# EAGLE design Anschlussfeld (EAGLE 5.09)
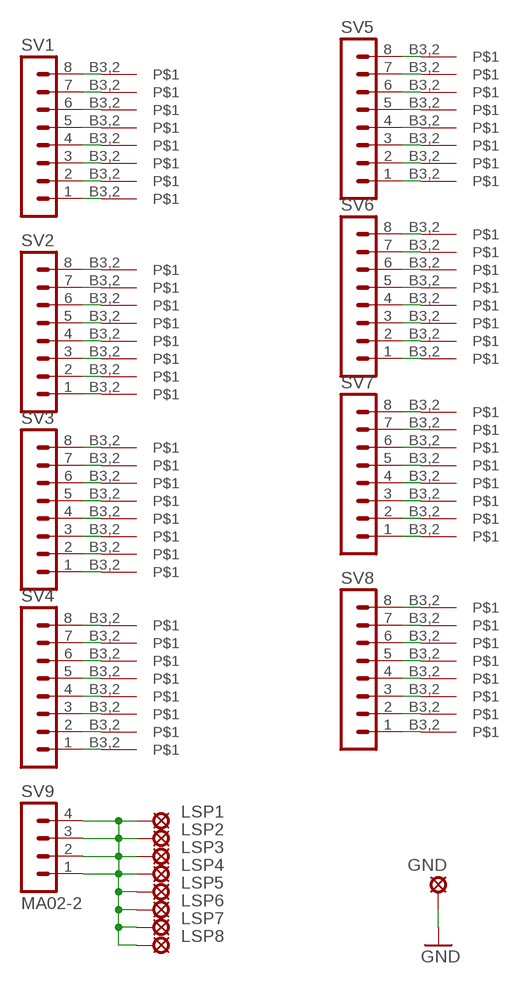
[diagram p0: schematic, sheet 1]

## Parts
GND  SE14  [SE14]
L1  SOLPAD_2,5  [3,2-PAD]
L2  SOLPAD_2,5  [3,2-PAD]
L3  SOLPAD_2,5  [3,2-PAD]
L4  SOLPAD_2,5  [3,2-PAD]
L5  SOLPAD_2,5  [3,2-PAD]
L6  SOLPAD_2,5  [3,2-PAD]
L7  SOLPAD_2,5  [3,2-PAD]
L8  SOLPAD_2,5  [3,2-PAD]
L9  SOLPAD_2,5  [3,2-PAD]
L10  SOLPAD_2,5  [3,2-PAD]
L11  SOLPAD_2,5  [3,2-PAD]
L12  SOLPAD_2,5  [3,2-PAD]
L13  SOLPAD_2,5  [3,2-PAD]
L14  SOLPAD_2,5  [3,2-PAD]
L15  SOLPAD_2,5  [3,2-PAD]
L16  SOLPAD_2,5  [3,2-PAD]
L17  SOLPAD_2,5  [3,2-PAD]
L18  SOLPAD_2,5  [3,2-PAD]
L19  SOLPAD_2,5  [3,2-PAD]
L20  SOLPAD_2,5  [3,2-PAD]
L21  SOLPAD_2,5  [3,2-PAD]
L22  SOLPAD_2,5  [3,2-PAD]
L23  SOLPAD_2,5  [3,2-PAD]
L24  SOLPAD_2,5  [3,2-PAD]
L25  SOLPAD_2,5  [3,2-PAD]
L26  SOLPAD_2,5  [3,2-PAD]
L27  SOLPAD_2,5  [3,2-PAD]
L28  SOLPAD_2,5  [3,2-PAD]
L29  SOLPAD_2,5  [3,2-PAD]
L30  SOLPAD_2,5  [3,2-PAD]
L31  SOLPAD_2,5  [3,2-PAD]
L32  SOLPAD_2,5  [3,2-PAD]
L33  SOLPAD_2,5  [3,2-PAD]
L34  SOLPAD_2,5  [3,2-PAD]
L35  SOLPAD_2,5  [3,2-PAD]
L36  SOLPAD_2,5  [3,2-PAD]
L37  SOLPAD_2,5  [3,2-PAD]
L38  SOLPAD_2,5  [3,2-PAD]
L39  SOLPAD_2,5  [3,2-PAD]
L40  SOLPAD_2,5  [3,2-PAD]
L41  SOLPAD_2,5  [3,2-PAD]
L42  SOLPAD_2,5  [3,2-PAD]
L43  SOLPAD_2,5  [3,2-PAD]
L44  SOLPAD_2,5  [3,2-PAD]
L45  SOLPAD_2,5  [3,2-PAD]
L46  SOLPAD_2,5  [3,2-PAD]
L47  SOLPAD_2,5  [3,2-PAD]
L48  SOLPAD_2,5  [3,2-PAD]
L49  SOLPAD_2,5  [3,2-PAD]
L50  SOLPAD_2,5  [3,2-PAD]
L51  SOLPAD_2,5  [3,2-PAD]
L52  SOLPAD_2,5  [3,2-PAD]
L53  SOLPAD_2,5  [3,2-PAD]
L54  SOLPAD_2,5  [3,2-PAD]
L55  SOLPAD_2,5  [3,2-PAD]
L56  SOLPAD_2,5  [3,2-PAD]
L57  SOLPAD_2,5  [3,2-PAD]
L58  SOLPAD_2,5  [3,2-PAD]
L59  SOLPAD_2,5  [3,2-PAD]
L60  SOLPAD_2,5  [3,2-PAD]
L61  SOLPAD_2,5  [3,2-PAD]
L62  SOLPAD_2,5  [3,2-PAD]
L63  SOLPAD_2,5  [3,2-PAD]
L64  SOLPAD_2,5  [3,2-PAD]
LSP1  SE14  [SE14]
LSP2  SE14  [SE14]
LSP3  SE14  [SE14]
LSP4  SE14  [SE14]
LSP5  SE14  [SE14]
LSP6  SE14  [SE14]
LSP7  SE14  [SE14]
LSP8  SE14  [SE14]
SV1  MA04-2  [MA04-2]
SV2  MA04-2  [MA04-2]
SV3  MA04-2  [MA04-2]
SV4  MA04-2  [MA04-2]
SV5  MA04-2  [MA04-2]
SV6  MA04-2  [MA04-2]
SV7  MA04-2  [MA04-2]
SV8  MA04-2  [MA04-2]
SV9  MA02-2  [MA02-2]

## Nets
GND: GND.MP
N$1: L9.B3,2 SV2.8
N$2: L10.B3,2 SV2.7
N$3: L11.B3,2 SV2.6
N$4: L12.B3,2 SV2.5
N$5: L13.B3,2 SV2.4
N$6: L14.B3,2 SV2.3
N$7: L15.B3,2 SV2.2
N$8: L16.B3,2 SV2.1
N$9: L1.B3,2 SV1.8
N$10: L2.B3,2 SV1.7
N$11: L3.B3,2 SV1.6
N$12: L4.B3,2 SV1.5
N$13: L5.B3,2 SV1.4
N$14: L6.B3,2 SV1.3
N$15: L7.B3,2 SV1.2
N$16: L8.B3,2 SV1.1
N$17: L17.B3,2 SV3.8
N$18: L18.B3,2 SV3.7
N$19: L19.B3,2 SV3.6
N$20: L20.B3,2 SV3.5
N$21: L21.B3,2 SV3.4
N$22: L22.B3,2 SV3.3
N$23: L23.B3,2 SV3.2
N$24: L24.B3,2 SV3.1
N$25: L25.B3,2 SV4.8
N$26: L26.B3,2 SV4.7
N$27: L27.B3,2 SV4.6
N$28: L28.B3,2 SV4.5
N$29: L29.B3,2 SV4.4
N$30: L30.B3,2 SV4.3
N$31: L31.B3,2 SV4.2
N$32: L32.B3,2 SV4.1
N$33: L33.B3,2 SV5.8
N$34: L34.B3,2 SV5.7
N$35: L35.B3,2 SV5.6
N$36: L36.B3,2 SV5.5
N$37: L37.B3,2 SV5.4
N$38: L38.B3,2 SV5.3
N$39: L39.B3,2 SV5.2
N$40: L40.B3,2 SV5.1
N$41: L41.B3,2 SV6.8
N$42: L42.B3,2 SV6.7
N$43: L43.B3,2 SV6.6
N$44: L44.B3,2 SV6.5
N$45: L45.B3,2 SV6.4
N$46: L46.B3,2 SV6.3
N$47: L47.B3,2 SV6.2
N$48: L48.B3,2 SV6.1
N$49: L49.B3,2 SV7.8
N$50: L50.B3,2 SV7.7
N$51: L51.B3,2 SV7.6
N$52: L52.B3,2 SV7.5
N$53: L53.B3,2 SV7.4
N$54: L54.B3,2 SV7.3
N$55: L55.B3,2 SV7.2
N$56: L56.B3,2 SV7.1
N$57: L57.B3,2 SV8.8
N$58: L58.B3,2 SV8.7
N$59: L59.B3,2 SV8.6
N$60: L60.B3,2 SV8.5
N$61: L61.B3,2 SV8.4
N$62: L62.B3,2 SV8.3
N$63: L63.B3,2 SV8.2
N$64: L64.B3,2 SV8.1
N$65: LSP1.MP LSP2.MP LSP3.MP LSP4.MP LSP5.MP LSP6.MP LSP7.MP LSP8.MP SV9.1 SV9.2 SV9.3 SV9.4

## Library data of the parts
GND LSP1-LSP8 = solpad:SE14: SOLDER PAD E1553, drill 1,4mm, distributor Buerklin, 07F820
L1-L64 = bbstghs:SOLPAD_2,5
SV1-SV8 = bbstghs:MA04-2: PIN HEADER
SV9 = bbstghs:MA02-2

## Board
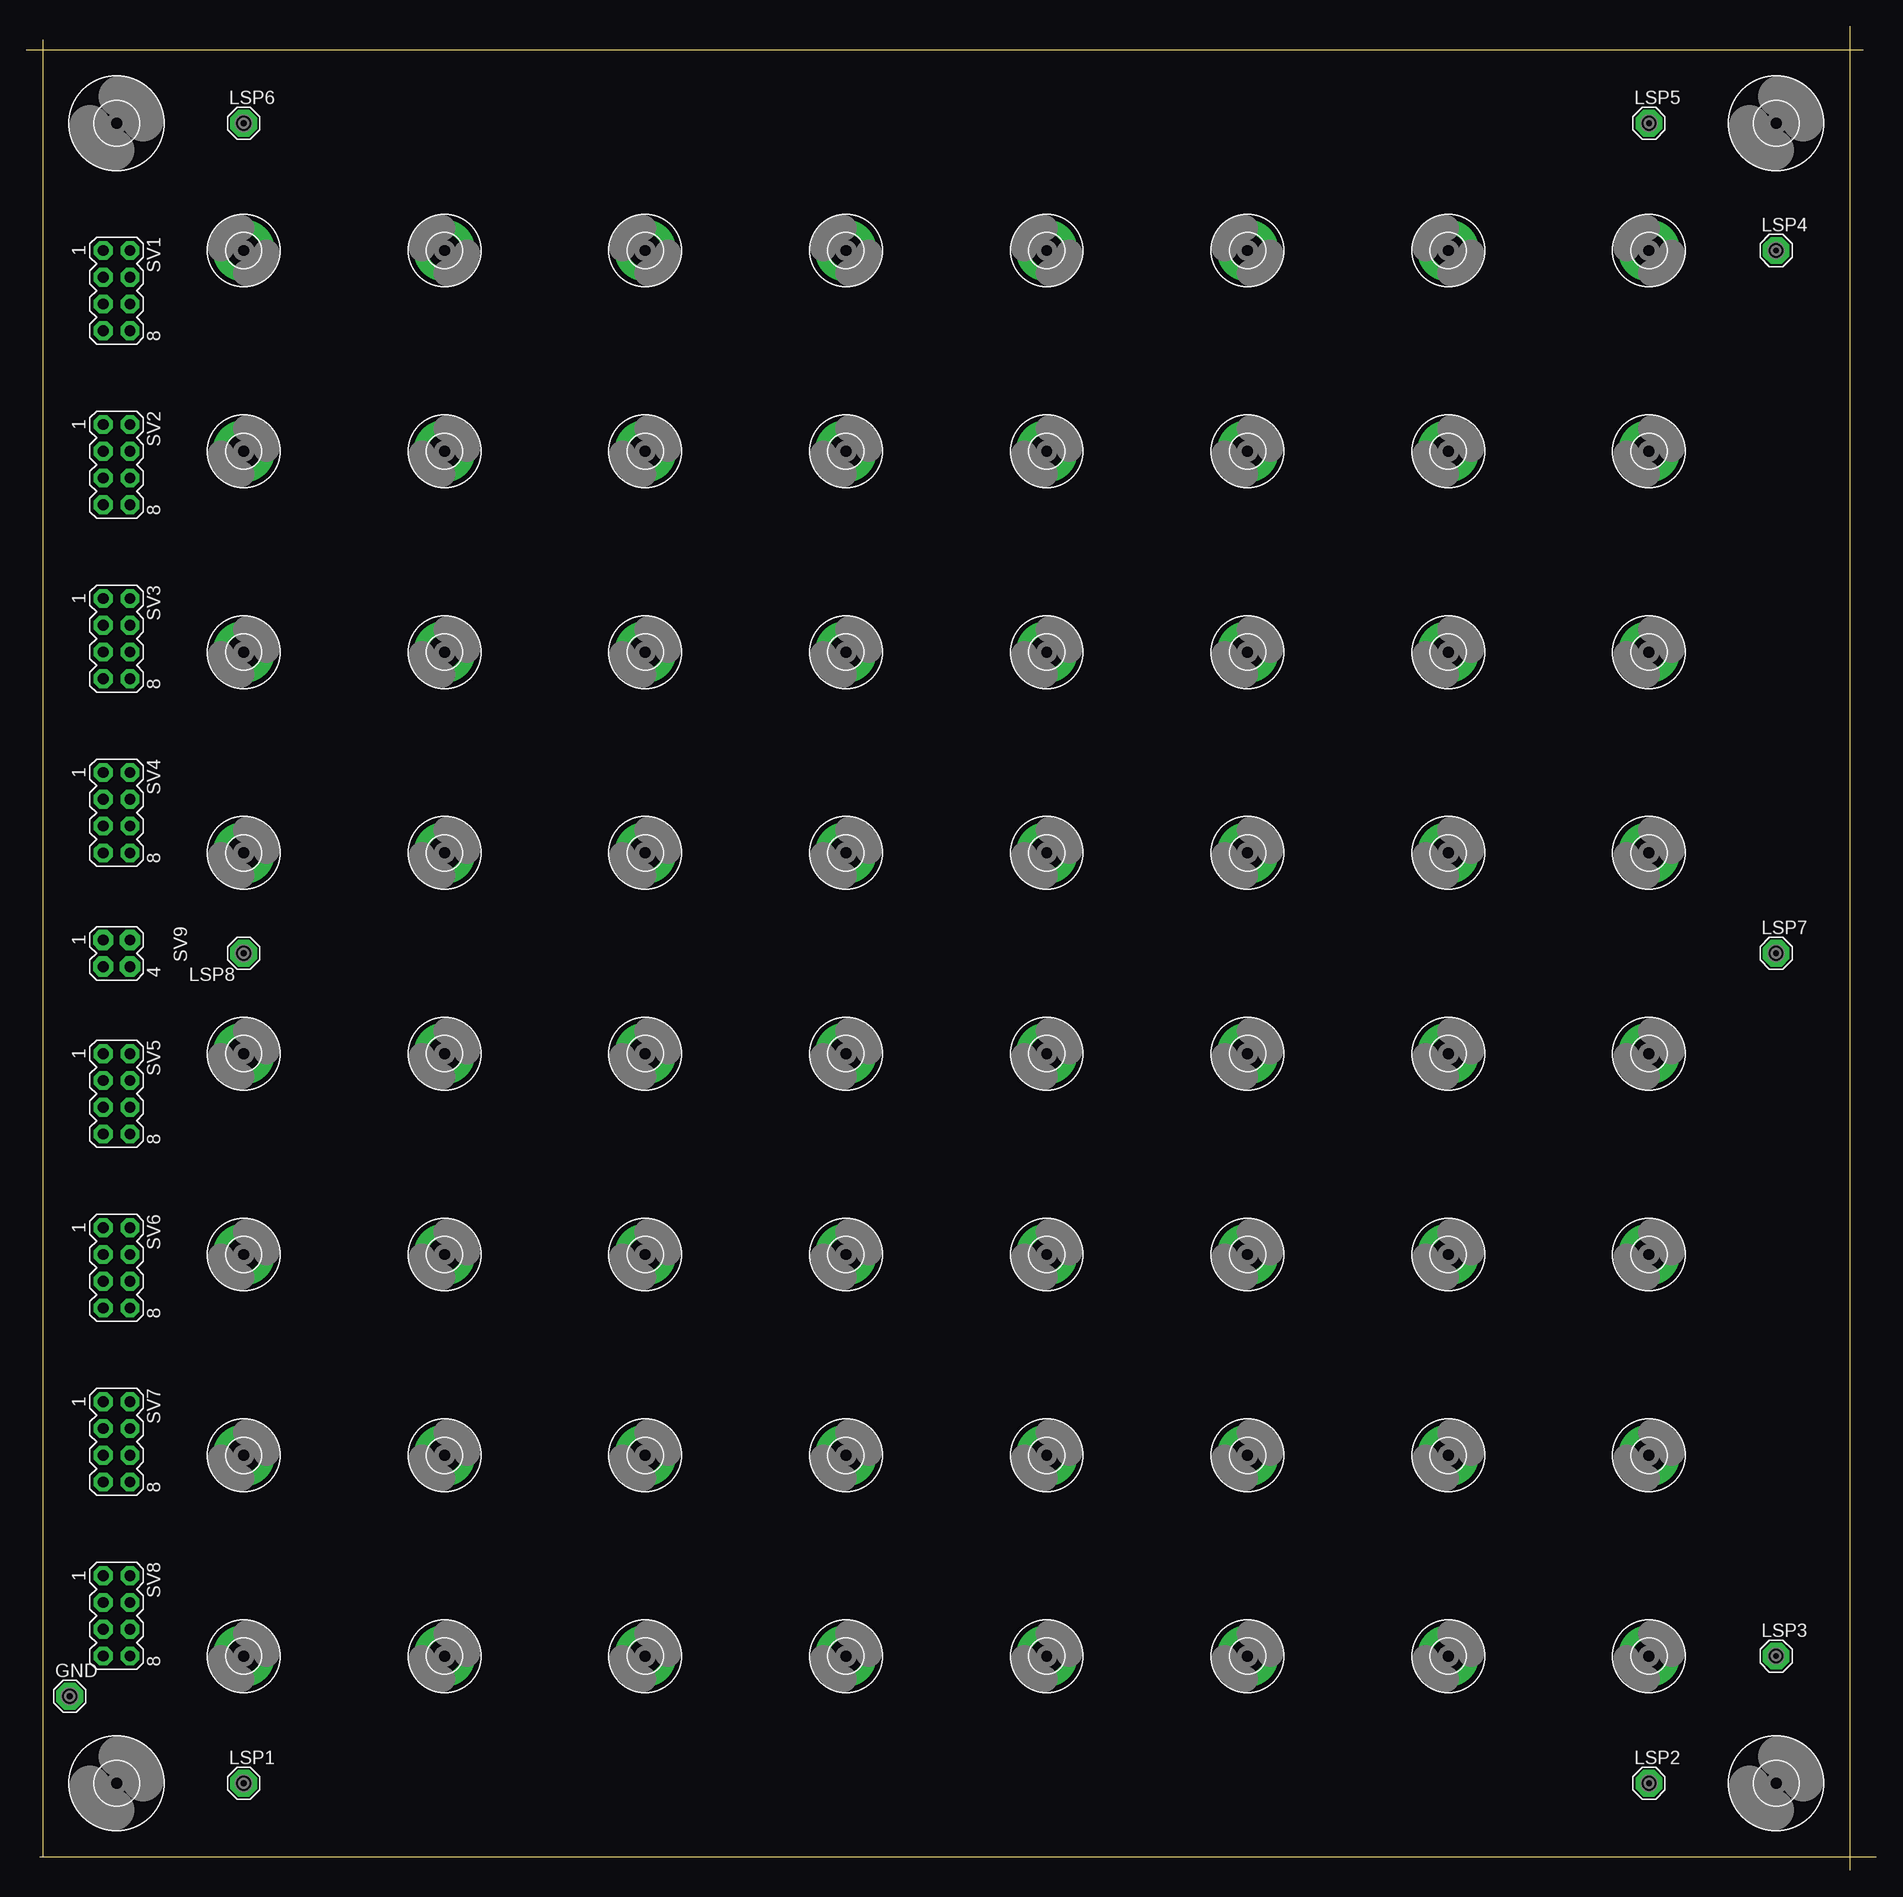
[diagram p1: board, top side]
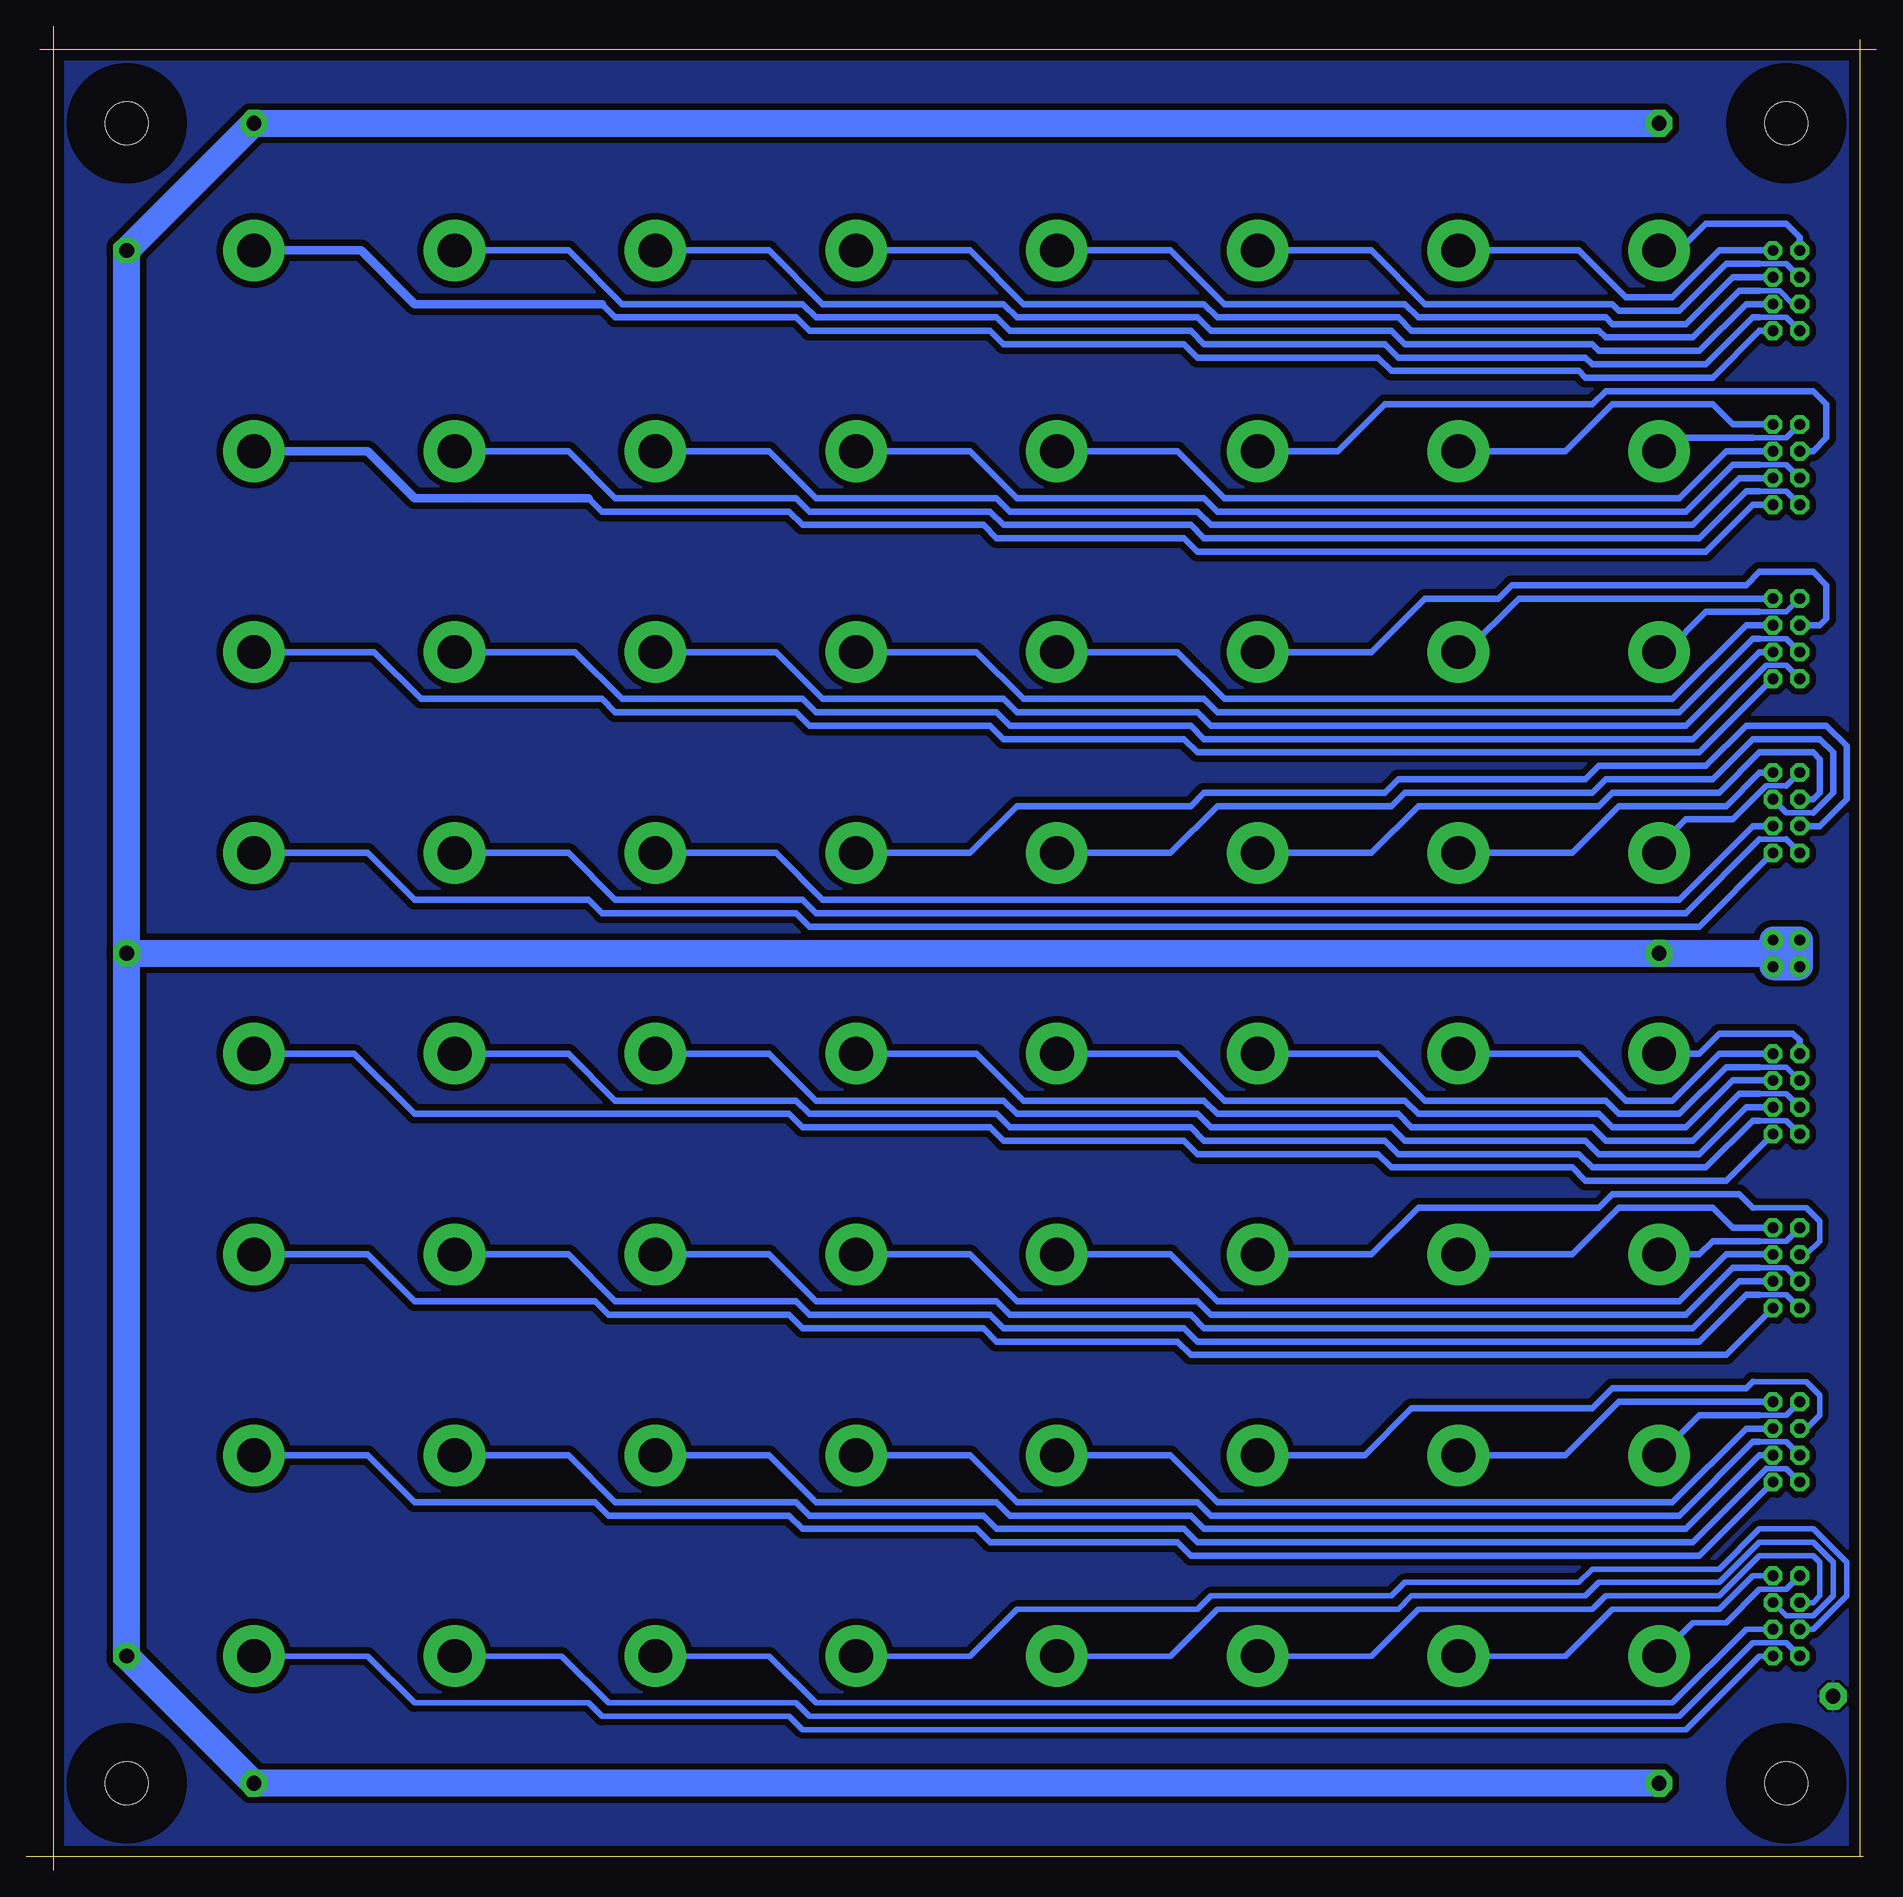
[diagram p2: board, bottom side, seen from below]

Size 175.56 x 174.93 mm. Coordinates in mm from the lower left corner, seen from the top.
Outline: 1.57,173.66 1.57,1.27
Outline: 0,172.72 174.29,172.72
Outline: 1.27,1.27 175.56,1.27
Outline: 173.02,174.93 173.02,0
Copper layers (1*16): Top 0.035mm / dielectric 1.5mm / Bottom 0.035mm
Design rules "default": minimum track width 10mil, minimum drill 24mil, track to track 8mil, track to pad 8mil, pad to pad 8mil, via to via 8mil, smd to smd 8mil, copper to edge 40mil, drill to drill 8mil, minimum pad ring 10mil, minimum via ring 8mil, stop-mask expansion 4mil, vias tented up to drill 0mil, thermal gap 10mil

### Footprints (pad centres in the part's own frame; a part is rotated, then mirrored left to right if it is on the bottom)
4,1 = hole 4.1: 0,0
SE14 = drill 1.397 pad 2.54 octagon: MP 0,0
3,2-PAD = drill 3.2 pad 5.842 round: B3,2 0,0
MA04-2 = drill 1.016 pad 1.778 octagon: 1 -3.81,-1.27; 2 -3.81,1.27; 3 -1.27,-1.27; 4 -1.27,1.27; 5 1.27,-1.27; 6 1.27,1.27; 7 3.81,-1.27; 8 3.81,1.27
MA02-2 = drill 1.016 pad 1.93 octagon: 1 -1.27,-1.27; 2 -1.27,1.27; 3 1.27,-1.27; 4 1.27,1.27

### Placement (x,y rotation side)
E$65  [4,1]  8.56,165.74 0 top
E$66  [4,1]  166.04,165.74 0 top
E$67  [4,1]  166.04,8.26 0 top
E$68  [4,1]  8.56,8.26 0 top
GND  4.12,16.51 0 top
L1  153.97,153.67 270 top
L2  134.92,153.67 270 top
L3  115.88,153.67 270 top
L4  96.83,153.67 270 top
L5  77.78,153.67 270 top
L6  58.73,153.67 270 top
L7  39.68,153.67 270 top
L8  20.62,153.67 270 top
L9  153.97,134.62 0 top
L10  134.92,134.62 0 top
L11  115.88,134.62 0 top
L12  96.83,134.62 0 top
L13  77.78,134.62 0 top
L14  58.73,134.62 0 top
L15  39.68,134.62 0 top
L16  20.62,134.62 0 top
L17  153.97,115.57 0 top
L18  134.92,115.57 0 top
L19  115.88,115.57 0 top
L20  96.83,115.57 0 top
L21  77.78,115.57 0 top
L22  58.73,115.57 0 top
L23  39.68,115.57 0 top
L24  20.62,115.57 0 top
L25  153.97,96.52 0 top
L26  134.92,96.52 0 top
L27  115.88,96.52 0 top
L28  96.83,96.52 0 top
L29  77.78,96.52 0 top
L30  58.73,96.52 0 top
L31  39.68,96.52 0 top
L32  20.62,96.52 0 top
L33  153.97,77.47 0 top
L34  134.92,77.47 0 top
L35  115.88,77.47 0 top
L36  96.83,77.47 0 top
L37  77.78,77.47 0 top
L38  58.73,77.47 0 top
L39  39.68,77.47 0 top
L40  20.62,77.47 0 top
L41  153.97,58.42 0 top
L42  134.92,58.42 0 top
L43  115.88,58.42 0 top
L44  96.83,58.42 0 top
L45  77.78,58.42 0 top
L46  58.73,58.42 0 top
L47  39.68,58.42 0 top
L48  20.62,58.42 0 top
L49  153.97,39.37 0 top
L50  134.92,39.37 0 top
L51  115.88,39.37 0 top
L52  96.83,39.37 0 top
L53  77.78,39.37 0 top
L54  58.73,39.37 0 top
L55  39.68,39.37 0 top
L56  20.62,39.37 0 top
L57  153.97,20.32 0 top
L58  134.92,20.32 0 top
L59  115.88,20.32 0 top
L60  96.83,20.32 0 top
L61  77.78,20.32 0 top
L62  58.73,20.32 0 top
L63  39.68,20.32 0 top
L64  20.62,20.32 0 top
LSP1  20.62,8.26 0 top
LSP2  153.97,8.26 0 top
LSP3  166.04,20.32 0 top
LSP4  166.04,153.67 0 top
LSP5  153.97,165.74 0 top
LSP6  20.62,165.74 0 top
LSP7  166.04,86.99 0 top
LSP8  20.62,86.99 0 top
SV1  8.56,149.86 270 top
SV2  8.56,133.35 270 top
SV3  8.56,116.84 270 top
SV4  8.56,100.33 270 top
SV5  8.56,73.66 270 top
SV6  8.56,57.15 270 top
SV7  8.56,40.64 270 top
SV8  8.56,24.13 270 top
SV9  8.56,86.99 270 top

### Tracks (layer width: path | path; a pad name or v marks a point on that pad's centre or on a via)
GND
  pour Bottom (isolate 0.61): 1.57,1.27 1.57,29.84 1.57,172.72 173.02,172.72 173.02,1.27
N$1
  Bottom 0.61: SV2.8 11.73,129.54 16.18,125.09 64.44,125.09 65.71,126.36 83.49,126.36 84.76,127.63 101.91,127.63 103.17,128.91 120.95,128.91 122.23,130.18
  Bottom 0.813: 122.23,130.18 138.73,130.18 143.18,134.62 L9.B3,2
N$2
  Bottom 0.508: SV2.7 8.56,130.81 11.1,130.81
  Bottom 0.61: 11.1,130.81 12.37,130.81 16.82,126.36 63.8,126.36 65.08,127.63 82.86,127.63 84.12,128.91 101.27,128.91 102.54,130.18 119.69,130.18 124.13,134.62 L10.B3,2
N$3
  Bottom 0.61: SV2.6 13,132.08 17.45,127.63 63.17,127.63 64.44,128.91 82.22,128.91 83.49,130.18 100.64,130.18 105.08,134.62 L11.B3,2
N$4
  Bottom 0.508: SV2.5 8.56,133.35 11.1,133.35
  Bottom 0.61: 11.1,133.35 13.64,133.35 18.09,128.91 62.54,128.91 63.8,130.18 81.59,130.18 86.03,134.62 L12.B3,2
N$5
  Bottom 0.61: SV2.4 14.27,134.62 18.72,130.18 61.9,130.18 66.34,134.62 L13.B3,2
N$6
  Bottom 0.61: SV2.3 6.02,134.62 4.75,135.89 4.75,139.06 6.02,140.34 25.7,140.34 26.97,139.06 46.66,139.06 51.11,134.62 L14.B3,2
N$7
  Bottom 0.61: SV2.2 13.64,137.16 15.54,139.06 25.07,139.06 29.52,134.62 L15.B3,2
N$8
  Bottom 0.508: SV2.1 8.56,135.89 11.73,135.89
  Bottom 0.61: L16.B3,2 19.36,135.89 11.73,135.89
N$9
  Bottom 0.61: SV1.8 11.1,146.05 15.54,141.61 27.61,141.61 28.25,142.24 46.03,142.24 47.3,143.51 64.44,143.51 65.71,144.78 82.86,144.78 84.12,146.05 101.27,146.05 102.54,147.32 119.69,147.32 120.95,148.59
  Bottom 0.813: 120.95,148.59 138.73,148.59 143.81,153.67 L1.B3,2
N$10
  Bottom 0.508: SV1.7 8.56,147.32 11.1,147.32
  Bottom 0.61: 11.1,147.32 11.73,147.32 16.18,142.88 26.97,142.88 27.61,143.51 45.39,143.51 46.66,144.78 63.8,144.78 65.08,146.05 82.22,146.05 83.49,147.32 100.64,147.32 101.91,148.59 119.05,148.59 124.13,153.67 L2.B3,2
N$11
  Bottom 0.61: SV1.6 12.37,148.59 16.82,144.15 26.34,144.15 26.97,144.78 44.76,144.78 46.03,146.05 63.17,146.05 64.44,147.32 81.59,147.32 82.86,148.59 100,148.59 105.08,153.67 L3.B3,2
N$12
  Bottom 0.508: SV1.5 7.92,148.59 9.2,149.86 11.1,149.86
  Bottom 0.61: 11.1,149.86 13,149.86 17.45,145.42 25.7,145.42 26.34,146.05 44.12,146.05 45.39,147.32 62.54,147.32 63.8,148.59 80.95,148.59 86.03,153.67 L4.B3,2
N$13
  Bottom 0.61: SV1.4 13.64,151.13 18.09,146.69 25.07,146.69 25.7,147.32 43.48,147.32 44.76,148.59 61.9,148.59 66.98,153.67 L5.B3,2
N$14
  Bottom 0.508: SV1.3 8.56,152.4 11.1,152.4
  Bottom 0.61: 11.1,152.4 14.27,152.4 18.72,147.96 24.43,147.96 25.07,148.59 42.85,148.59 47.93,153.67 L6.B3,2
N$15
  Bottom 0.61: SV1.2 14.91,153.67 19.36,149.23 23.8,149.23 28.25,153.67 L7.B3,2
N$16
  Bottom 0.61: SV1.1 7.29,154.94 8.56,156.21 16.18,156.21 18.72,153.67 L8.B3,2
N$17
  Bottom 0.61: L17.B3,2 142.54,115.57 138.1,111.12 120.95,111.12 119.69,109.85 102.54,109.85 101.27,108.58 84.12,108.58 82.86,107.31 65.71,107.31 64.44,106.05 16.82,106.05 SV3.8
N$18
  Bottom 0.508: SV3.7 8.56,114.3 10.46,114.3 17.45,107.31
  Bottom 0.61: 17.45,107.31 63.8,107.31 65.08,108.58 82.22,108.58 83.49,109.85 100.64,109.85 101.91,111.12 119.05,111.12 123.5,115.57 L18.B3,2
N$19
  Bottom 0.61: SV3.6 11.1,115.57 18.09,108.58 63.17,108.58 64.44,109.85 81.59,109.85 82.86,111.12 100,111.12 104.45,115.57 L19.B3,2
N$20
  Bottom 0.508: SV3.5 8.56,116.84 11.1,116.84
  Bottom 0.61: 11.1,116.84 11.73,116.84 18.72,109.85 62.54,109.85 63.8,111.12 80.95,111.12 85.39,115.57 L20.B3,2
N$21
  Bottom 0.61: SV3.4 12.37,118.11 19.36,111.12 61.9,111.12 66.34,115.57 L21.B3,2
N$22
  Bottom 0.61: SV3.3 5.38,118.11 4.75,118.74 4.75,121.92 6.02,123.19 11.1,123.19 12.37,121.92 34.6,121.92 35.87,120.65 42.85,120.65 47.93,115.57 L22.B3,2
N$23
  Bottom 0.61: SV3.2 33.96,120.65 39.04,115.57 L23.B3,2
N$24
  Bottom 0.508: SV3.1 8.56,119.38 11.1,119.38
  Bottom 0.61: 11.1,119.38 16.18,119.38 19.99,115.57 L24.B3,2
N$25
  Bottom 0.61: SV4.8 16.82,89.53 101.27,89.53 102.54,90.8 120.95,90.8 122.23,92.08 138.73,92.08 143.18,96.52 L25.B3,2
N$26
  Bottom 0.508: 8.56,97.79 11.1,97.79
  Bottom 0.61: SV4.7 8.56,97.79 | 11.1,97.79 18.09,90.8 100.64,90.8 101.91,92.08 119.69,92.08 124.13,96.52 L26.B3,2
N$27
  Bottom 0.61: SV4.6 11.73,99.06 18.72,92.08 100,92.08 104.45,96.52 L27.B3,2
N$28
  Bottom 0.61: SV4.5 5.38,99.06 2.84,101.6 2.84,106.68 4.75,108.58 12.37,108.58 16.18,104.77 26.34,104.77 27.61,103.5 45.39,103.5 46.66,102.23 63.8,102.23 65.08,100.96 81.59,100.96 86.03,96.52 L28.B3,2
N$29
  Bottom 0.508: SV4.4 8.56,100.33 6.02,100.33
  Bottom 0.61: 6.02,100.33 4.12,102.23 4.12,106.05 5.38,107.31 11.73,107.31 15.54,103.5 25.7,103.5 26.97,102.23 44.76,102.23 46.03,100.96 62.54,100.96 66.98,96.52 L29.B3,2
N$30
  Bottom 0.61: SV4.3 6.02,101.6 5.38,102.23 5.38,105.41 6.02,106.05 11.1,106.05 14.91,102.23 25.07,102.23 26.34,100.96 43.48,100.96 47.93,96.52 L30.B3,2
N$31
  Bottom 0.61: L31.B3,2 28.88,96.52 24.43,100.96 14.27,100.96 11.1,104.14 SV4.2
N$32
  Bottom 0.508: 8.56,102.87 10.46,102.87 13.64,99.69
  Bottom 0.61: SV4.1 8.56,102.87 | 20.62,99.06 L32.B3,2 20.62,97.16 18.09,99.69 13.64,99.69
N$33
  Bottom 0.61: SV5.8 14.27,65.41 27.61,65.41 28.88,66.67 46.03,66.67 47.3,67.94 64.44,67.94 65.71,69.21 82.86,69.21 84.12,70.48 101.91,70.48 103.17,71.75 138.73,71.75 144.45,77.47 L33.B3,2
N$34
  Bottom 0.508: SV5.7 8.56,71.12 11.1,71.12
  Bottom 0.61: 11.1,71.12 11.73,71.12 16.18,66.67 26.97,66.67 28.25,67.94 45.39,67.94 46.66,69.21 63.8,69.21 65.08,70.48 82.22,70.48 83.49,71.75 101.27,71.75 102.54,73.02 119.69,73.02 124.13,77.47 L34.B3,2
N$35
  Bottom 0.61: SV5.6 12.37,72.39 16.82,67.94 26.34,67.94 27.61,69.21 44.76,69.21 46.03,70.48 63.17,70.48 64.44,71.75 81.59,71.75 82.86,73.02 100.64,73.02 105.08,77.47 L35.B3,2
N$36
  Bottom 0.508: SV5.5 8.56,73.66 11.1,73.66
  Bottom 0.61: 11.1,73.66 13,73.66 17.45,69.21 25.7,69.21 26.97,70.48 44.12,70.48 45.39,71.75 62.54,71.75 63.8,73.02 80.95,73.02 85.39,77.47 L36.B3,2
N$37
  Bottom 0.61: SV5.4 13.64,74.93 18.09,70.48 25.07,70.48 26.34,71.75 43.48,71.75 44.76,73.02 61.9,73.02 66.34,77.47 L37.B3,2
N$38
  Bottom 0.508: SV5.3 8.56,76.2 11.1,76.2
  Bottom 0.61: 11.1,76.2 14.27,76.2 18.72,71.75 24.43,71.75 25.7,73.02 42.85,73.02 47.3,77.47 L38.B3,2
N$39
  Bottom 0.61: SV5.2 14.91,77.47 19.36,73.02 23.8,73.02 28.25,77.47 L39.B3,2
N$40
  Bottom 0.61: SV5.1 7.29,78.74 7.92,79.38 14.91,79.38 16.82,77.47 L40.B3,2
N$41
  Bottom 0.61: SV6.8 14.27,48.9 65.08,48.9 66.34,50.17 83.49,50.17 84.76,51.44 101.91,51.44 103.17,52.71 120.32,52.71 121.59,53.98 138.73,53.98 143.18,58.42 L41.B3,2
N$42
  Bottom 0.508: SV6.7 8.56,54.61 11.1,54.61
  Bottom 0.61: 11.1,54.61 12.37,54.61 16.82,50.17 64.44,50.17 65.71,51.44 82.86,51.44 84.12,52.71 101.27,52.71 102.54,53.98 119.69,53.98 124.13,58.42 L42.B3,2
N$43
  Bottom 0.61: SV6.6 13,55.88 17.45,51.44 63.8,51.44 65.08,52.71 82.22,52.71 83.49,53.98 100.64,53.98 105.08,58.42 L43.B3,2
N$44
  Bottom 0.508: SV6.5 8.56,57.15 11.1,57.15
  Bottom 0.61: 11.1,57.15 13.64,57.15 18.09,52.71 63.17,52.71 64.44,53.98 81.59,53.98 86.03,58.42 L44.B3,2
N$45
  Bottom 0.61: SV6.4 14.27,58.42 18.72,53.98 62.54,53.98 66.98,58.42 L45.B3,2
N$46
  Bottom 0.508: SV6.3 6.66,58.42 5.38,59.69 5.38,61.6 6.66,62.87 11.73,62.87
  Bottom 0.61: 11.73,62.87 13,64.14 25.07,64.14 26.34,62.87 43.48,62.87 47.93,58.42 L46.B3,2
N$47
  Bottom 0.61: SV6.2 13.64,60.96 15.54,62.87 24.43,62.87 28.88,58.42 L47.B3,2
N$48
  Bottom 0.508: SV6.1 8.56,59.69 11.1,59.69
  Bottom 0.61: 11.1,59.69 15.54,59.69 16.82,58.42 L48.B3,2
N$49
  Bottom 0.61: SV7.8 16.82,29.84 65.08,29.84 66.34,31.11 84.12,31.11 85.39,32.38 101.91,32.38 103.17,33.66 120.32,33.66 121.59,34.93 138.73,34.93 143.18,39.37 L49.B3,2
N$50
  Bottom 0.508: SV7.7 8.56,38.1 10.46,38.1
  Bottom 0.61: 10.46,38.1 17.45,31.11 64.44,31.11 65.71,32.38 83.49,32.38 84.76,33.66 101.27,33.66 102.54,34.93 119.69,34.93 124.13,39.37 L50.B3,2
N$51
  Bottom 0.61: SV7.6 11.1,39.37 18.09,32.38 63.8,32.38 65.08,33.66 82.22,33.66 83.49,34.93 100.64,34.93 105.08,39.37 L51.B3,2
N$52
  Bottom 0.508: SV7.5 8.56,40.64 11.1,40.64
  Bottom 0.61: 11.1,40.64 11.73,40.64 18.72,33.66 63.17,33.66 64.44,34.93 81.59,34.93 86.03,39.37 L52.B3,2
N$53
  Bottom 0.61: SV7.4 12.37,41.91 19.36,34.93 62.54,34.93 66.98,39.37 L53.B3,2
N$54
  Bottom 0.508: SV7.3 6.66,41.91 5.38,43.18 5.38,45.09 6.66,46.36 11.73,46.36
  Bottom 0.61: 11.73,46.36 12.37,45.72 25.07,45.72 26.97,43.82 44.12,43.82 48.57,39.37 L54.B3,2 59.36,39.37
N$55
  Bottom 0.61: SV7.2 24.43,44.45 29.52,39.37 L55.B3,2
N$56
  Bottom 0.508: SV7.1 8.56,43.18 11.1,43.18
  Bottom 0.61: 11.1,43.18 16.82,43.18 L56.B3,2
N$57
  Bottom 0.508: SV8.8 11.1,20.32 18.09,13.33 101.91,13.33 103.17,14.61 120.95,14.61 122.23,15.88 138.73,15.88 143.18,20.32 L57.B3,2
N$58
  Bottom 0.508: SV8.7 8.56,21.59 11.73,21.59 18.72,14.61 101.27,14.61 102.54,15.88 120.32,15.88 124.77,20.32 L58.B3,2
N$59
  Bottom 0.508: SV8.6 12.37,22.86 19.36,15.88 100.64,15.88 105.08,20.32 L59.B3,2
N$60
  Bottom 0.508: SV8.5 6.02,22.86 2.84,26.04 2.84,29.21 6.02,32.38 11.1,32.38 14.91,28.57 26.97,28.57 28.25,27.3 44.76,27.3 46.03,26.04 63.17,26.04 64.44,24.77 81.59,24.77 86.03,20.32 L60.B3,2
N$61
  Bottom 0.508: SV8.4 8.56,24.13 6.02,24.13 4.12,26.04 4.12,29.21 6.02,31.11 11.1,31.11 14.91,27.3 26.34,27.3 27.61,26.04 44.12,26.04 45.39,24.77 62.54,24.77 66.98,20.32 L61.B3,2
N$62
  Bottom 0.508: SV8.3 6.02,25.4 5.38,26.04 5.38,29.21 6.02,29.84 11.1,29.84 14.91,26.04 25.7,26.04 26.97,24.77 43.48,24.77 47.93,20.32 L62.B3,2
N$63
  Bottom 0.508: SV8.2 11.73,27.94 14.91,24.77 25.07,24.77 29.52,20.32 L63.B3,2
N$64
  Bottom 0.508: SV8.1 8.56,26.67 11.1,26.67 14.27,23.5 17.45,23.5 L64.B3,2
N$65
  Bottom 1.27: 9.83,86.99 8.56,86.99
  Bottom 1.778: 8.56,86.99 SV9.3
  Bottom 2.54: LSP7.MP LSP8.MP 9.83,86.99 | LSP7.MP LSP4.MP LSP5.MP LSP6.MP | LSP7.MP LSP3.MP LSP2.MP LSP1.MP | 9.83,86.99 SV9.4 SV9.3 SV9.1 SV9.2 9.83,86.99